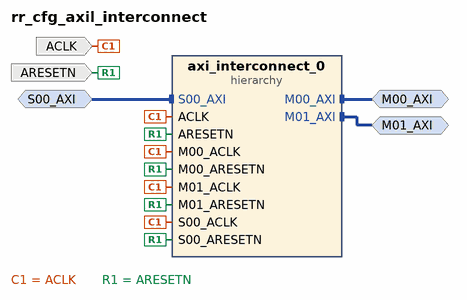
[diagram p0: block diagram of the top level]
# Vivado block design rr_cfg_axil_interconnect, xcvu9p-flgb2104-2-i, Vivado 2020.2
create_bd_design rr_cfg_axil_interconnect

create_bd_intf_port -mode Slave -vlnv xilinx.com:interface:aximm_rtl:1.0 S00_AXI
set_property -dict [list \
  CONFIG.ADDR_WIDTH 32 \
  CONFIG.ARUSER_WIDTH 0 \
  CONFIG.AWUSER_WIDTH 0 \
  CONFIG.BUSER_WIDTH 0 \
  CONFIG.DATA_WIDTH 32 \
  CONFIG.FREQ_HZ 10000000 \
  CONFIG.HAS_BRESP 1 \
  CONFIG.HAS_BURST 0 \
  CONFIG.HAS_CACHE 0 \
  CONFIG.HAS_LOCK 0 \
  CONFIG.HAS_PROT 1 \
  CONFIG.HAS_QOS 0 \
  CONFIG.HAS_REGION 0 \
  CONFIG.HAS_RRESP 1 \
  CONFIG.HAS_WSTRB 1 \
  CONFIG.ID_WIDTH 0 \
  CONFIG.MAX_BURST_LENGTH 1 \
  CONFIG.NUM_READ_OUTSTANDING 1 \
  CONFIG.NUM_READ_THREADS 1 \
  CONFIG.NUM_WRITE_OUTSTANDING 1 \
  CONFIG.NUM_WRITE_THREADS 1 \
  CONFIG.PROTOCOL AXI4LITE \
  CONFIG.READ_WRITE_MODE READ_WRITE \
  CONFIG.RUSER_BITS_PER_BYTE 0 \
  CONFIG.RUSER_WIDTH 0 \
  CONFIG.SUPPORTS_NARROW_BURST 0 \
  CONFIG.WUSER_BITS_PER_BYTE 0 \
  CONFIG.WUSER_WIDTH 0 \
] [get_bd_intf_ports S00_AXI]
create_bd_intf_port -mode Master -vlnv xilinx.com:interface:aximm_rtl:1.0 M00_AXI
set_property -dict [list \
  CONFIG.ADDR_WIDTH 32 \
  CONFIG.DATA_WIDTH 32 \
  CONFIG.FREQ_HZ 10000000 \
  CONFIG.HAS_BURST 0 \
  CONFIG.HAS_CACHE 0 \
  CONFIG.HAS_LOCK 0 \
  CONFIG.HAS_QOS 0 \
  CONFIG.HAS_REGION 0 \
  CONFIG.PROTOCOL AXI4LITE \
] [get_bd_intf_ports M00_AXI]
create_bd_intf_port -mode Master -vlnv xilinx.com:interface:aximm_rtl:1.0 M01_AXI
set_property -dict [list \
  CONFIG.ADDR_WIDTH 32 \
  CONFIG.DATA_WIDTH 32 \
  CONFIG.FREQ_HZ 10000000 \
  CONFIG.HAS_BURST 0 \
  CONFIG.HAS_CACHE 0 \
  CONFIG.HAS_LOCK 0 \
  CONFIG.HAS_QOS 0 \
  CONFIG.HAS_REGION 0 \
  CONFIG.PROTOCOL AXI4LITE \
] [get_bd_intf_ports M01_AXI]
create_bd_port -dir I -type clk ACLK
set_property -dict {CONFIG.ASSOCIATED_BUSIF S00_AXI:M00_AXI:M01_AXI CONFIG.FREQ_HZ 10000000} [get_bd_ports ACLK]
create_bd_port -dir I -type rst ARESETN

create_bd_cell -type hier axi_interconnect_0
set_property -dict {CONFIG.ENABLE_ADVANCED_OPTIONS 1 CONFIG.SYNCHRONIZATION_STAGES 2} [get_bd_cells axi_interconnect_0]

# ---- hierarchy /axi_interconnect_0 ----
current_bd_instance /axi_interconnect_0
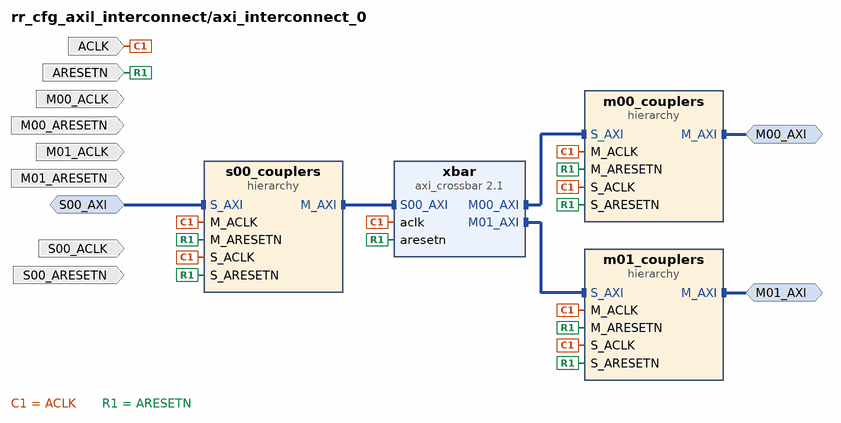
[diagram p1: block diagram inside /axi_interconnect_0]
create_bd_intf_pin -mode Slave -vlnv xilinx.com:interface:aximm_rtl:1.0 S00_AXI
create_bd_intf_pin -mode Master -vlnv xilinx.com:interface:aximm_rtl:1.0 M00_AXI
create_bd_intf_pin -mode Master -vlnv xilinx.com:interface:aximm_rtl:1.0 M01_AXI
create_bd_pin -dir I -type clk ACLK
create_bd_pin -dir I -type rst ARESETN
create_bd_pin -dir I -type clk S00_ACLK
create_bd_pin -dir I -type rst S00_ARESETN
create_bd_pin -dir I -type clk M00_ACLK
create_bd_pin -dir I -type rst M00_ARESETN
create_bd_pin -dir I -type clk M01_ACLK
create_bd_pin -dir I -type rst M01_ARESETN

create_bd_cell -type ip -vlnv xilinx.com:ip:axi_crossbar:2.1 xbar
set_property -dict [list \
  CONFIG.NUM_MI 2 \
  CONFIG.NUM_SI 1 \
  CONFIG.PROTOCOL AXI4LITE \
  CONFIG.R_REGISTER 1 \
  CONFIG.STRATEGY 0 \
] [get_bd_cells xbar]
create_bd_cell -type hier s00_couplers
create_bd_cell -type hier m00_couplers
create_bd_cell -type hier m01_couplers

# ---- hierarchy /axi_interconnect_0/s00_couplers ----
current_bd_instance /axi_interconnect_0/s00_couplers
create_bd_intf_pin -mode Master -vlnv xilinx.com:interface:aximm_rtl:1.0 M_AXI
create_bd_intf_pin -mode Slave -vlnv xilinx.com:interface:aximm_rtl:1.0 S_AXI
create_bd_pin -dir I -type clk M_ACLK
create_bd_pin -dir I -type rst M_ARESETN
create_bd_pin -dir I -type clk S_ACLK
create_bd_pin -dir I -type rst S_ARESETN

# ---- hierarchy /axi_interconnect_0/m00_couplers ----
current_bd_instance /axi_interconnect_0/m00_couplers
create_bd_intf_pin -mode Master -vlnv xilinx.com:interface:aximm_rtl:1.0 M_AXI
create_bd_intf_pin -mode Slave -vlnv xilinx.com:interface:aximm_rtl:1.0 S_AXI
create_bd_pin -dir I -type clk M_ACLK
create_bd_pin -dir I -type rst M_ARESETN
create_bd_pin -dir I -type clk S_ACLK
create_bd_pin -dir I -type rst S_ARESETN

# ---- hierarchy /axi_interconnect_0/m01_couplers ----
current_bd_instance /axi_interconnect_0/m01_couplers
create_bd_intf_pin -mode Master -vlnv xilinx.com:interface:aximm_rtl:1.0 M_AXI
create_bd_intf_pin -mode Slave -vlnv xilinx.com:interface:aximm_rtl:1.0 S_AXI
create_bd_pin -dir I -type clk M_ACLK
create_bd_pin -dir I -type rst M_ARESETN
create_bd_pin -dir I -type clk S_ACLK
create_bd_pin -dir I -type rst S_ARESETN

# ---- connections ----

current_bd_instance /axi_interconnect_0
connect_bd_intf_net [get_bd_intf_pins xbar/M01_AXI] [get_bd_intf_pins m01_couplers/S_AXI]
connect_bd_intf_net [get_bd_intf_pins M00_AXI] [get_bd_intf_pins m00_couplers/M_AXI]
connect_bd_intf_net [get_bd_intf_pins S00_AXI] [get_bd_intf_pins s00_couplers/S_AXI]
connect_bd_intf_net [get_bd_intf_pins xbar/M00_AXI] [get_bd_intf_pins m00_couplers/S_AXI]
connect_bd_intf_net [get_bd_intf_pins s00_couplers/M_AXI] [get_bd_intf_pins xbar/S00_AXI]
connect_bd_intf_net [get_bd_intf_pins M01_AXI] [get_bd_intf_pins m01_couplers/M_AXI]
connect_bd_net -net axi_interconnect_0_ACLK_net [get_bd_pins ACLK] \
  [get_bd_pins xbar/aclk] [get_bd_pins s00_couplers/S_ACLK] [get_bd_pins s00_couplers/M_ACLK] \
  [get_bd_pins m00_couplers/M_ACLK] [get_bd_pins m01_couplers/M_ACLK] [get_bd_pins m00_couplers/S_ACLK] \
  [get_bd_pins m01_couplers/S_ACLK]
connect_bd_net -net axi_interconnect_0_ARESETN_net [get_bd_pins ARESETN] \
  [get_bd_pins xbar/aresetn] [get_bd_pins s00_couplers/S_ARESETN] [get_bd_pins s00_couplers/M_ARESETN] \
  [get_bd_pins m00_couplers/M_ARESETN] [get_bd_pins m01_couplers/M_ARESETN] [get_bd_pins m00_couplers/S_ARESETN] \
  [get_bd_pins m01_couplers/S_ARESETN]

current_bd_instance /axi_interconnect_0/s00_couplers
connect_bd_intf_net [get_bd_intf_pins S_AXI] [get_bd_intf_pins M_AXI]

current_bd_instance /axi_interconnect_0/m00_couplers
connect_bd_intf_net [get_bd_intf_pins S_AXI] [get_bd_intf_pins M_AXI]

current_bd_instance /axi_interconnect_0/m01_couplers
connect_bd_intf_net [get_bd_intf_pins S_AXI] [get_bd_intf_pins M_AXI]

current_bd_instance /
connect_bd_intf_net [get_bd_intf_ports S00_AXI] [get_bd_intf_pins axi_interconnect_0/S00_AXI]
connect_bd_intf_net [get_bd_intf_ports M01_AXI] [get_bd_intf_pins axi_interconnect_0/M01_AXI]
connect_bd_intf_net [get_bd_intf_ports M00_AXI] [get_bd_intf_pins axi_interconnect_0/M00_AXI]
connect_bd_net [get_bd_ports ACLK] \
  [get_bd_pins axi_interconnect_0/ACLK] [get_bd_pins axi_interconnect_0/M00_ACLK] [get_bd_pins axi_interconnect_0/M01_ACLK] \
  [get_bd_pins axi_interconnect_0/S00_ACLK]
connect_bd_net [get_bd_ports ARESETN] \
  [get_bd_pins axi_interconnect_0/ARESETN] [get_bd_pins axi_interconnect_0/M00_ARESETN] \
  [get_bd_pins axi_interconnect_0/M01_ARESETN] [get_bd_pins axi_interconnect_0/S00_ARESETN]

# ---- address map ----
assign_bd_address -offset 0x00000000 -range 1M -target_address_space [get_bd_addr_spaces S00_AXI] [get_bd_addr_segs M00_AXI/Reg]
assign_bd_address -offset 0x00100000 -range 1M -target_address_space [get_bd_addr_spaces S00_AXI] [get_bd_addr_segs M01_AXI/Reg]

validate_bd_design
save_bd_design
